# EAGLE design Arduino FTDI UART (EAGLE 7.5.0)
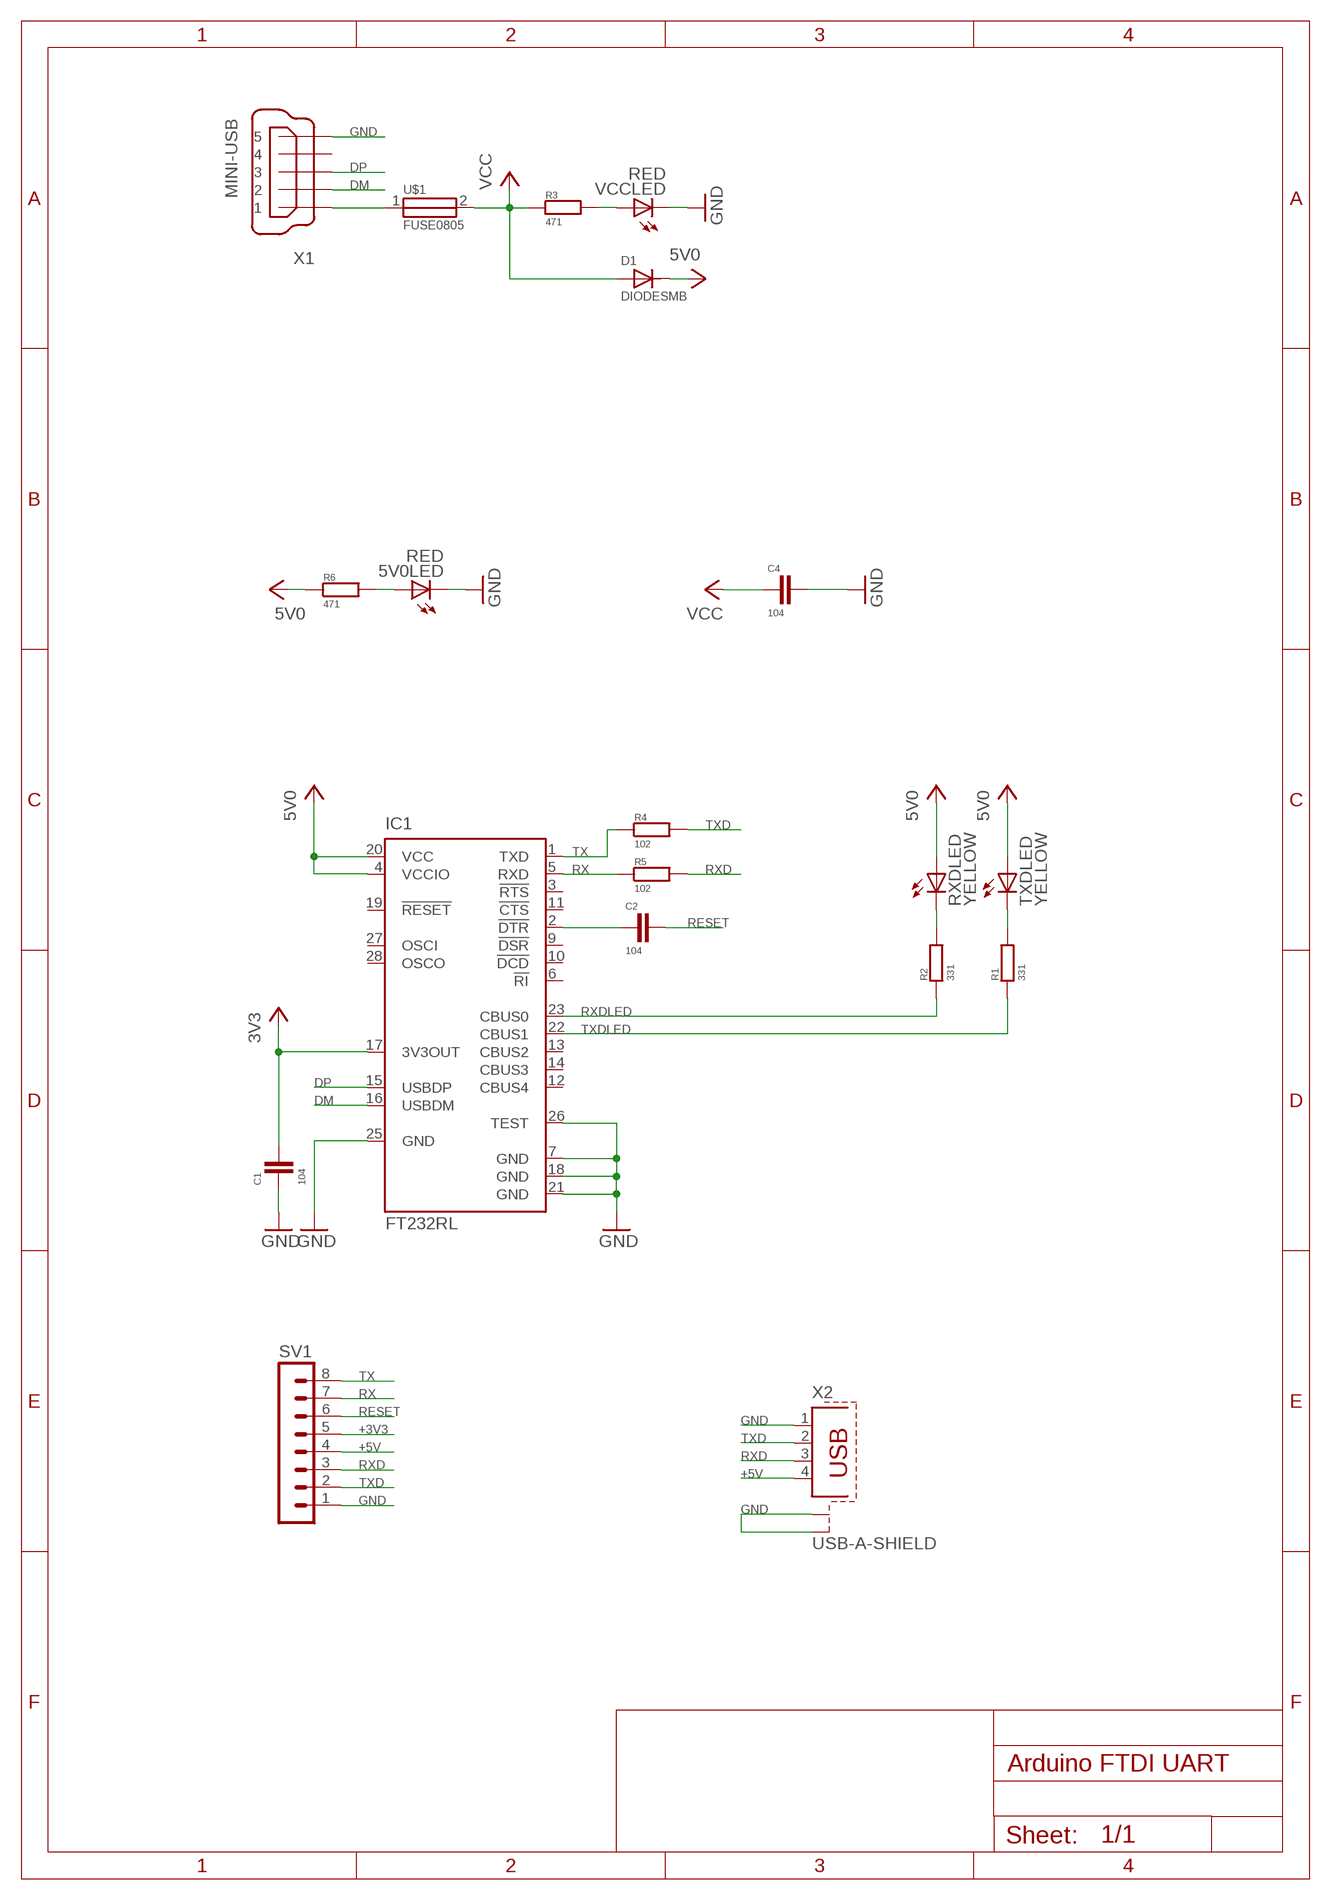
[diagram p0: schematic, sheet 1]

## Parts
5V0LED  RED  LEDCHIPLED_0805  [CHIPLED_0805]
C1  104  CC0805  [C0805]
C2  104  CC0805  [C0805]
C4  104  CC0805  [C0805]
D1  DIODESMB  [SMB]
IC1  FT232RL  [SSOP28]
R1  331  RR0805  [R0805]
R2  331  RR0805  [R0805]
R3  471  RR0805  [R0805]
R4  102  RR0805  [R0805]
R5  102  RR0805  [R0805]
R6  471  RR0805  [R0805]
RXDLED  YELLOW  LEDCHIPLED_0805  [CHIPLED_0805]
SV1  MA08-1  [MA08-1]
TXDLED  YELLOW  LEDCHIPLED_0805  [CHIPLED_0805]
U$1  FUSE0805  [F0805]
VCCLED  RED  LEDCHIPLED_0805  [CHIPLED_0805]
X1  MINI-USB  MINI-USB-32005-201  [32005-201]
X2  USB-A-SHIELD  [USB-A-SHIELD]

## Nets
+3V3: C1.1 IC1.17(3V3OUT) SV1.5 ; supply symbol labelled 3V3
+5V: D1.1 IC1.4(VCCIO) IC1.20(VCC) R6.1 RXDLED.A SV1.4 TXDLED.A X2.4 ; supply symbol labelled 5V0
DM: IC1.16(USBDM) X1.2
DP: IC1.15(USBDP) X1.3
GND: 5V0LED.C C1.2 C4.1 IC1.7(GND) IC1.18(GND) IC1.21(GND) IC1.25(GND) IC1.26(TEST) SV1.1 VCCLED.C X1.5 X2.1 X2.S1 X2.S2
N$1: R2.2 RXDLED.C
N$3: U$1.1 X1.1
N$4: R1.2 TXDLED.C
N$5: R3.2 VCCLED.A
N$6: C2.2 IC1.2(!DTR)
N$9: 5V0LED.A R6.2
RESET: C2.1 SV1.6
RX: IC1.5(RXD) R5.1 SV1.7
RXD: R5.2 SV1.3 X2.3
RXDLED: IC1.23(CBUS0) R2.1
TX: IC1.1(TXD) R4.1 SV1.8
TXD: R4.2 SV1.2 X2.2
TXDLED: IC1.22(CBUS1) R1.1
VCC: C4.2 D1.2 R3.1 U$1.2
Unconnected: IC1.3(!RTS) IC1.6(!RI) IC1.9(!DSR) IC1.10(!DCD) IC1.11(!CTS) IC1.12(CBUS4) IC1.13(CBUS2) IC1.14(CBUS3) IC1.19(!RESET) IC1.27(OSCI) IC1.28(OSCO) X1.4

## Library data of the parts
5V0LED RXDLED TXDLED VCCLED = Display:LED: LED OSRAM: - CHIPLED LG R971, LG N971, LY N971, LG Q971, LY Q971, LO R971, LY R971 LH N974, LH R974 LS Q976, LO Q976, LY Q976 LO Q996 - Hyper CHIPLED LW Q18S LB Q993, LB Q99A, LB R99A - SideLED LS A670, LO A670, LY A670, LG A670, LP A670 LB A673, LV A673, LT A673, LW A673 LH A674 LY A675 LS A676, LA A676, LO A676, LY A676, LW A676 LS A679, LY A679, LG A679 - Hyper Micro SIDELED® LS Y876, LA Y876, LO Y876, LY Y876 LT Y87S - SmartLED LW L88C, LW L88S LB L89C, LB L89S, LG L890 LS L89K, LO L89K, LY L89K LS L896, LA L896, LO L896, LY L896 - TOPLED LS T670, LO T670, LY T670, LG T670, LP T670 LSG T670, LSP T670, LSY T670, LOP T670, LYG T670 LG T671, LOG T671, LSG T671 LB T673, LV T673, LT T673, LW T673 LH T674 LS T676, LA T676, LO T676, LY T676, LB T676, LH T676, LSB T676, LW T676 LB T67C, LV T67C, LT T67C, LS T67K, LO T67K, LY T67K, LW E67C LS E67B, LA E67B, LO E67B, LY E67B, LB E67C, LV E67C, LT E67C LW T67C LS T679, LY T679, LG T679 LS T770, LO T770, LY T770, LG T770, LP T770 LB T773, LV T773, LT T773, LW T773 LH T774 LS E675, LA E675, LY E675, LS T675 LS T776, LA T776, LO T776, LY T776, LB T776 LHGB T686 LT T68C, LB T68C - Hyper Mini TOPLED® LB M676 - Mini TOPLED Santana® LG M470 LS M47K, LO M47K, LY M47K Source: http://www.osram.convergy.de LUXEON: - LUMILED® LXK2-PW12-R00, LXK2-PW12-S00, LXK2-PW14-U00, LXK2-PW14-V00 LXK2-PM12-R00, LXK2-PM12-S00, LXK2-PM14-U00 LXK2-PE12-Q00, LXK2-PE12-R00, LXK2-PE12-S00, LXK2-PE14-T00, LXK2-PE14-U00 LXK2-PB12-K00, LXK2-PB12-L00, LXK2-PB12-M00, LXK2-PB14-N00, LXK2-PB14-P00, LXK2-PB14-Q00 LXK2-PR12-L00, LXK2-PR12-M00, LXK2-PR14-Q00, LXK2-PR14-R00 LXK2-PD12-Q00, LXK2-PD12-R00, LXK2-PD12-S00 LXK2-PH12-R00, LXK2-PH12-S00 LXK2-PL12-P00, LXK2-PL12-Q00, LXK2-PL12-R00 Source: www.luxeon.com KINGBRIGHT: KA-3528ASYC Source: www.kingbright.com
C1 C2 C4 = RCLDA:C: CAPACITOR
D1 = RCLDA:DIODE: DIODE
IC1 = Chip:FT232R: Source: http://www.ftdichip.com/Documents/DataSheets/DS_FT232R_v104.pdf; MPN: FT232RL; OC_FARNELL: 1146032; OC_NEWARK: 91K9918
R1-R6 = RCLDA:R: RESISTOR
SV1 = Pin-Header:MA08-1: PIN HEADER; OC_FARNELL: unknown; OC_NEWARK: unknown
U$1 = RCLDA:FUSE
X1 = Socket:MINI-USB-: MINI USB-B Conector Source: www.cypressindustries.com; OC_FARNELL: unknown; OC_NEWARK: unknown
X2 = Socket:USB-A-SHIELD: USB A型母座（带可焊接固定脚）; OC_FARNELL: unknown; OC_NEWARK: unknown

## Board
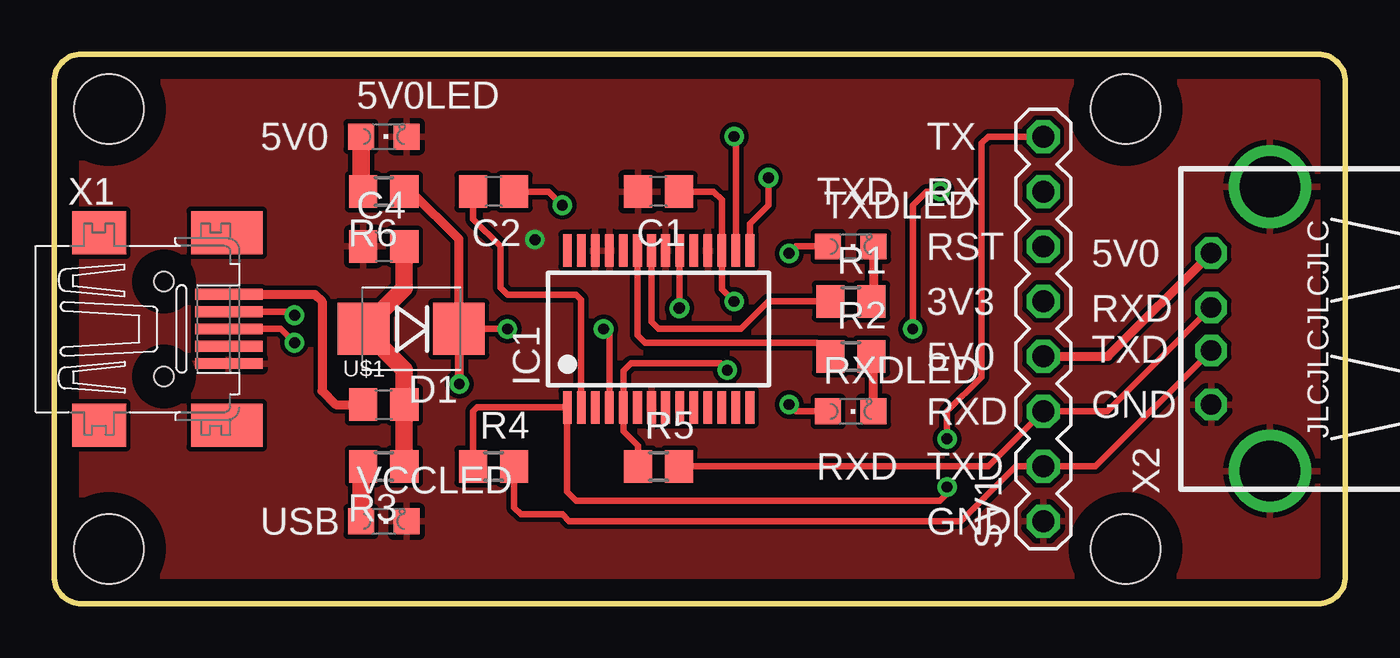
[diagram p1: board, top side]
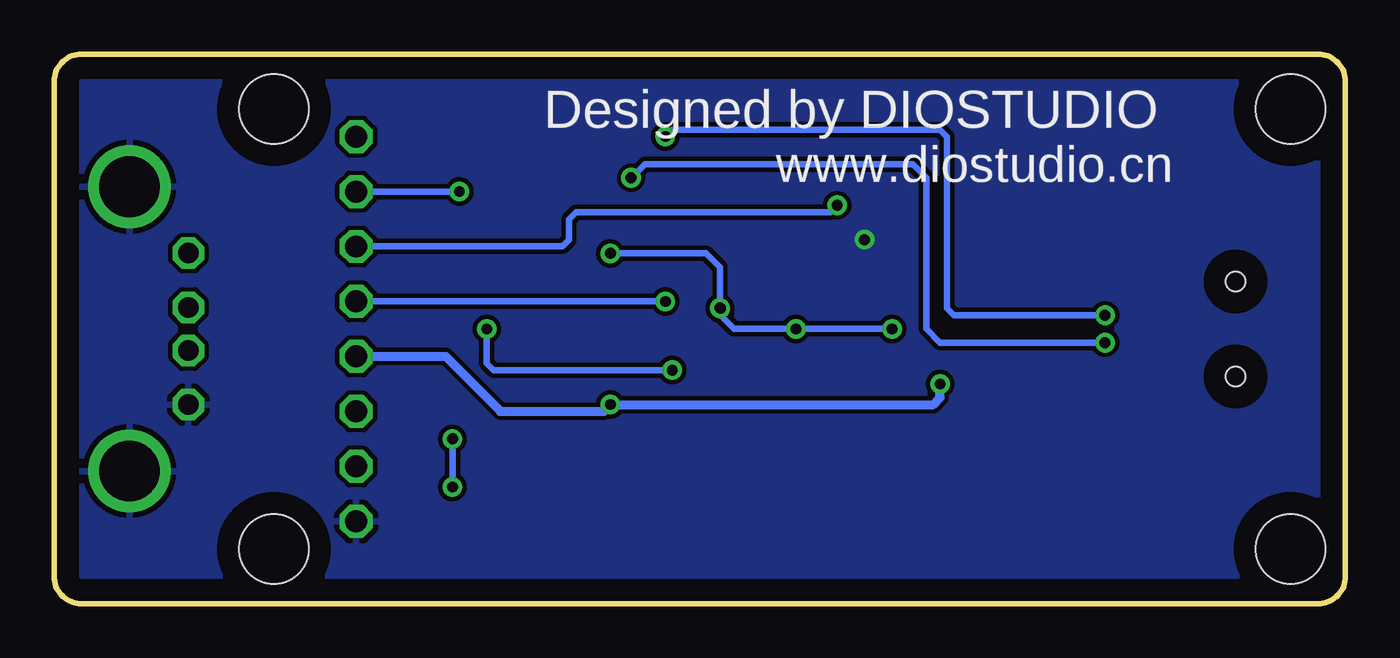
[diagram p2: board, bottom side, seen from below]

Size 59.69 x 25.4 mm. Coordinates in mm from the lower left corner, seen from the top.
Outline: 0,24.13 arc-90 1.27,25.4 58.42,25.4 arc-90 59.69,24.13 59.69,1.27 arc-90 58.42,0 1.27,0 arc-90 0,1.27 0,24.13
Copper layers (1*16): Top 0.035mm / dielectric 1.5mm / Bottom 0.035mm
Design rules "default *": minimum track width 10mil, minimum drill 24mil, track to track 8mil, track to pad 8mil, pad to pad 8mil, via to via 8mil, smd to smd 8mil, copper to edge 40mil, drill to drill 8mil, minimum pad ring 10mil, minimum via ring 8mil, stop-mask expansion 4mil, vias tented up to drill 0.5mm, thermal gap 10mil
Holes 3.2 mm at 2.54,22.86 2.54,2.54 49.53,22.86 49.53,2.54

### Footprints (pad centres in the part's own frame; a part is rotated, then mirrored left to right if it is on the bottom)
CHIPLED_0805 = smd 1.2 x 1.2: A 0,-1.05; C 0,1.05
C0805 = smd 1.3 x 1.5: 1 -0.95,0; 2 0.95,0
SMB = smd 2.4 x 2.4: 1 -2.2,0; 2 2.2,0
SSOP28 = smd 0.4 x 1.5: 1 -4.225,-3.625; 2 -3.575,-3.625; 3 -2.925,-3.625; 4 -2.275,-3.625; 5 -1.625,-3.625; 6 -0.975,-3.625; 7 -0.325,-3.625; 8 0.325,-3.625; 9 0.975,-3.625; 10 1.625,-3.625; 11 2.275,-3.625; 12 2.925,-3.625; 13 3.575,-3.625; 14 4.225,-3.625; 15 4.225,3.625; 16 3.575,3.625; 17 2.925,3.625; 18 2.275,3.625; 19 1.625,3.625; 20 0.975,3.625; 21 0.325,3.625; 22 -0.325,3.625; 23 -0.975,3.625; 24 -1.625,3.625; 25 -2.275,3.625; 26 -2.925,3.625; 27 -3.575,3.625; 28 -4.225,3.625
R0805 = smd 1.3 x 1.5: 1 -0.95,0; 2 0.95,0
MA08-1 = drill 1.016 octagon: 1 -8.89,0; 2 -6.35,0; 3 -3.81,0; 4 -1.27,0; 5 1.27,0; 6 3.81,0; 7 6.35,0; 8 8.89,0
F0805 = smd 1.3 x 1.5: 1 -0.95,0; 2 0.95,0
32005-201 = smd 3.1 x 0.5: 1 3,1.6; 2 3,0.8; 3 3,0; 4 3,-0.8; 5 3,-1.6 | smd 2.5 x 2: M1 -3,-4.45; M2 -3,4.45 | smd 3.3 x 2: M3 2.9,4.45; M4 2.9,-4.45 | hole 0.9: 0,2.2; 0,-2.2
USB-A-SHIELD = drill 0.95 octagon: 1 -3.5,2.71; 2 -1,2.71; 3 1,2.71; 4 3.5,2.71 | drill 2.8: S1 -6.57,0; S2 6.57,0

### Placement (x,y rotation side)
5V0LED  15.24,21.59 270 top
C1  27.94,19.05 180 top
C2  20.32,19.05 180 top
C4  15.24,16.51 0 top
D1  16.51,12.7 180 top
IC1  27.94,12.7 0 top
R1  36.83,13.97 0 top
R2  36.83,11.43 0 top
R3  15.24,6.35 180 top
R4  20.32,6.35 0 top
R5  27.94,6.35 0 top
R6  15.24,19.05 180 top
RXDLED  36.83,8.89 270 top
SV1  45.72,12.7 90 top
TXDLED  36.83,16.51 270 top
U$1  15.24,9.21 0 top
VCCLED  15.24,3.81 270 top
X1  5.08,12.7 0 top
X2  56.2,12.7 90 top

### Tracks (layer width: path | path; a pad name or v marks a point on that pad's centre or on a via)
+3V3  (via drill 0.5)
  Top 0.305: C1.1 30.48,19.05 30.86,18.66 IC1.17 30.86,14.54 v31.43,13.97
  Bottom 0.305: SV1.5 v31.43,13.97
+5V  (via drill 0.5)
  Top 0.305: RXDLED.A 34.29,8.89 v33.97,9.21 | v33.97,16.19 34.29,16.51 TXDLED.A | v20.95,12.7 D1.1 18.73,12.68 | IC1.4 25.66,12.44 v25.4,12.7 | IC1.20 v28.91,13.68
  Top 0.406: D1.1 18.71,16.85 16.51,19.05 R6.1 | v18.73,10.16 18.73,12.68 | SV1.4 48.72,11.43 X2.4
  Bottom 0.305: v20.95,12.7 v25.4,12.7 28.26,12.7 28.91,13.36 v28.91,13.68 28.91,15.56 29.55,16.19 v33.97,16.19
  Bottom 0.406: SV1.4 41.59,11.43 39.05,8.89 34.29,8.89 v33.97,9.21 19.05,9.21 18.73,9.53 v18.73,10.16
DM  (via drill 0.5)
  Top 0.305: X1.2 10.95,13.5 v11.11,13.34 | IC1.16 31.52,21.51 v31.43,21.59
  Bottom 0.305: v11.11,13.34 18.1,13.34 18.41,13.65 18.41,21.59 18.73,21.91 31.11,21.91 v31.43,21.59
DP  (via drill 0.5)
  Top 0.305: X1.3 10.48,12.7 v11.11,12.06 | v33.02,19.68 33.02,18.41 32.16,17.56 IC1.15
  Bottom 0.305: v11.11,12.06 18.73,12.06 19.37,12.7 19.37,19.68 20,20.32 32.38,20.32 v33.02,19.68
GND  (via drill 0.5)
  other vias: 22.23,16.83
  pour Bottom: 0,1.27 0,24.13 arc-90 1.27,25.4 58.42,25.4 arc-90 59.69,24.13 59.69,1.27 arc-90 58.42,0 1.27,0 arc-90
  pour Top: 0,1.27 0,24.13 arc-90 1.27,25.4 58.42,25.4 arc-90 59.69,24.13 59.69,1.27 arc-90 58.42,0 1.27,0 arc-90
N$1
  Top 0.406: RXDLED.C 37.88,11.33 R2.2
N$2  (via drill 0.5)
  other vias: 28.89,13.65
N$3
  Top 0.406: X1.1 12.05,14.3 12.38,13.97 12.38,9.84 13.02,9.21 U$1.1
N$4
  Top 0.406: TXDLED.C 37.88,14.07 R1.2
N$5
  Top 0.813: VCCLED.A 14.19,6.25 R3.2
N$6
  Top 0.305: IC1.2 24.36,14.05 24.13,14.29 20.95,14.29 20.64,14.61 20.64,16.51 19.37,17.78 C2.2
N$9
  Top 0.813: 5V0LED.A 14.19,19.15 R6.2
RESET  (via drill 0.5)
  Top 0.305: C2.1 22.86,19.05 v23.5,18.41
  Bottom 0.305: SV1.6 36.2,16.51 35.88,16.83 35.88,17.78 35.56,18.1 23.81,18.1 v23.5,18.41
RX  (via drill 0.5)
  Top 0.305: R5.1 26.99,7.3 26.32,7.97 IC1.5 26.32,10.76 26.67,11.11 30.8,11.11 v31.11,10.79 | v39.69,12.7 39.69,18.41 40.32,19.05 v40.96,19.05
  Bottom 0.305: v31.11,10.79 39.37,10.79 39.69,11.11 v39.69,12.7 | v40.96,19.05 SV1.7
RXD
  Top 0.305: R5.2 43.18,6.35 SV1.3 48.68,8.89 X2.3
RXDLED
  Top 0.305: IC1.23 26.96,12.4 27.3,12.06 35.24,12.06 R2.1
TX  (via drill 0.5)
  Top 0.305: R4.1 19.37,8.89 19.55,9.07 IC1.1 23.71,5.18 24.13,4.76 40.96,4.76 41.27,5.08 v41.27,5.4 | SV1.8 43.18,21.59 42.86,21.27 42.86,10.48 41.27,8.89 v41.27,7.62
  Bottom 0.305: v41.27,5.4 v41.27,7.62
TXD
  Top 0.305: R4.2 21.27,4.45 21.59,4.13 23.5,4.13 23.81,3.81 41.91,3.81 44.45,6.35 SV1.2 48.14,6.35 X2.2
TXDLED
  Top 0.305: IC1.22 27.61,13.03 27.94,12.7 31.75,12.7 33.02,13.97 R1.1
VCC
  Top 0.813: C4.2 16.19,14.58 D1.2 16.19,10.82 U$1.2 R3.1

### Text on the board
tPlace: 5V0 | TX | TXD | RX | RST | 5V0 | 3V3 | RXD | JLCJLCJLCJLC | 5V0 | TXD | GND | RXD | RXD | TXD | USB | GND
bPlace: Designed by DIOSTUDIO | www.diostudio.cn